# EAGLE design sensors_r (EAGLE 9.5.1)
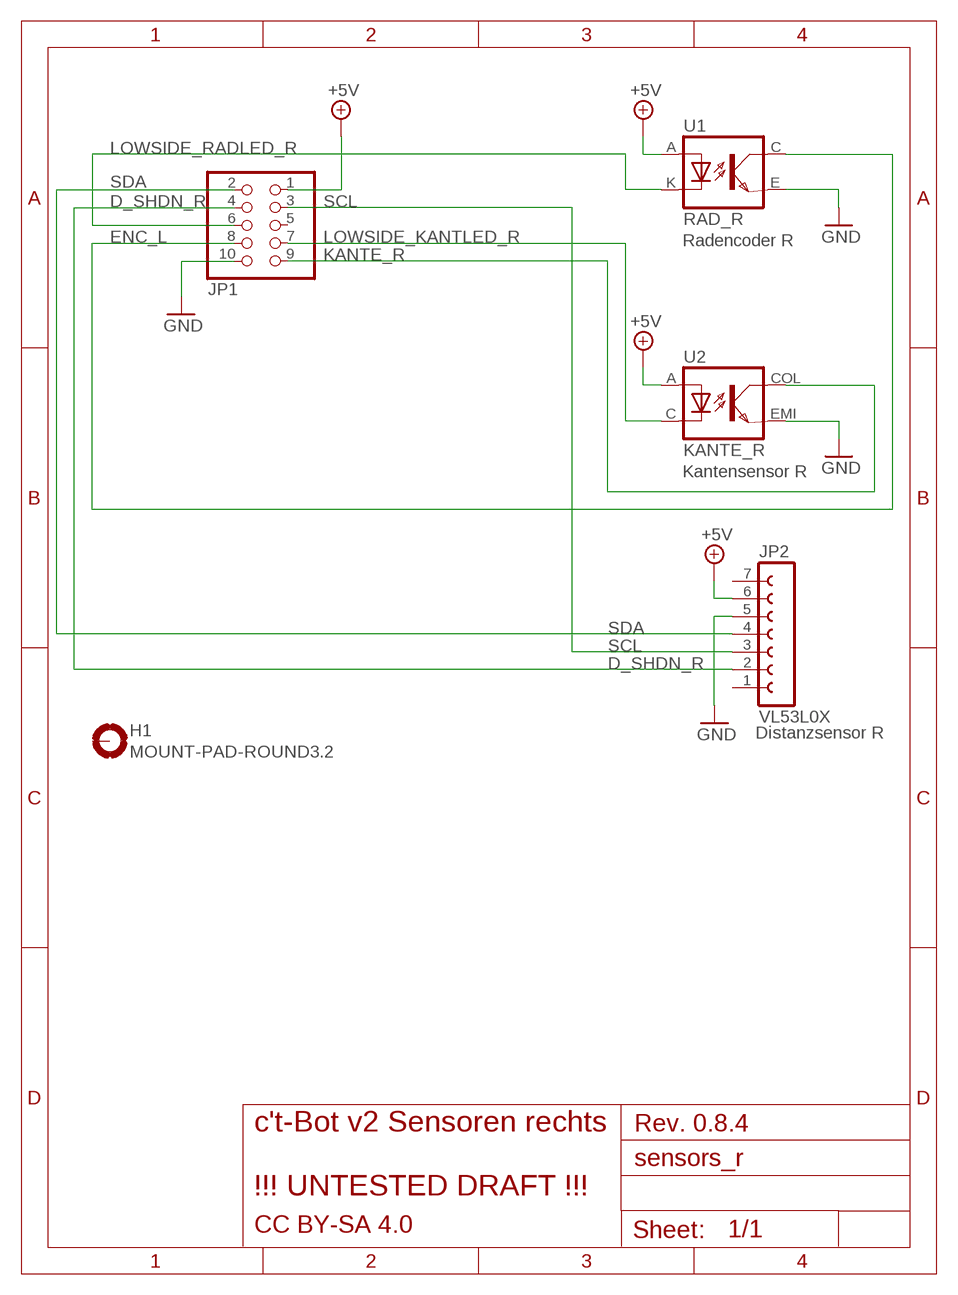
[diagram p0: schematic, sheet 1]

## Parts
H1  MOUNT-PAD-ROUND3.2  [3,2-PAD]
JP1  PINHD-2X5  [2X05]
JP2  VL53L0X  FE07W  [FE07W]
U1  RAD_R  CNY70DEF  [4]
U2  KANTE_R  CNY70  [EDGE]

## Nets
+5V: JP1.1 JP2.6 U1.A U2.A
D_SHDN_R: JP1.4 JP2.2
ENC_L: JP1.8 U1.C(COL)
GND: JP1.10 JP2.5 U1.E(EMI) U2.EMI
KANTE_R: JP1.9 U2.COL
LOWSIDE_KANTLED_R: JP1.7 U2.C
LOWSIDE_RADLED_R: JP1.6 U1.K(C)
SCL: JP1.3 JP2.3
SDA: JP1.2 JP2.4
Unconnected: H1.B3,2(MOUNT) JP1.5 JP2.1 JP2.7

## Notes on the sheet
- Radencoder R
- Kantensensor R
- Distanzsensor R
- Rev. 0.8.4
- c't-Bot v2 Sensoren rechts
  
  !!! UNTESTED DRAFT !!!
- CC BY-SA 4.0

## Library data of the parts
H1 = holes:MOUNT-PAD-ROUND: MOUNTING PAD, round
JP1 = pinhead:PINHD-2X5: PIN HEADER
JP2 = ct-bot:FE07W: FEMALE HEADER; OC_FARNELL: unknown; OC_NEWARK: unknown
U1 U2 = ct-bot:CNY70

## Board
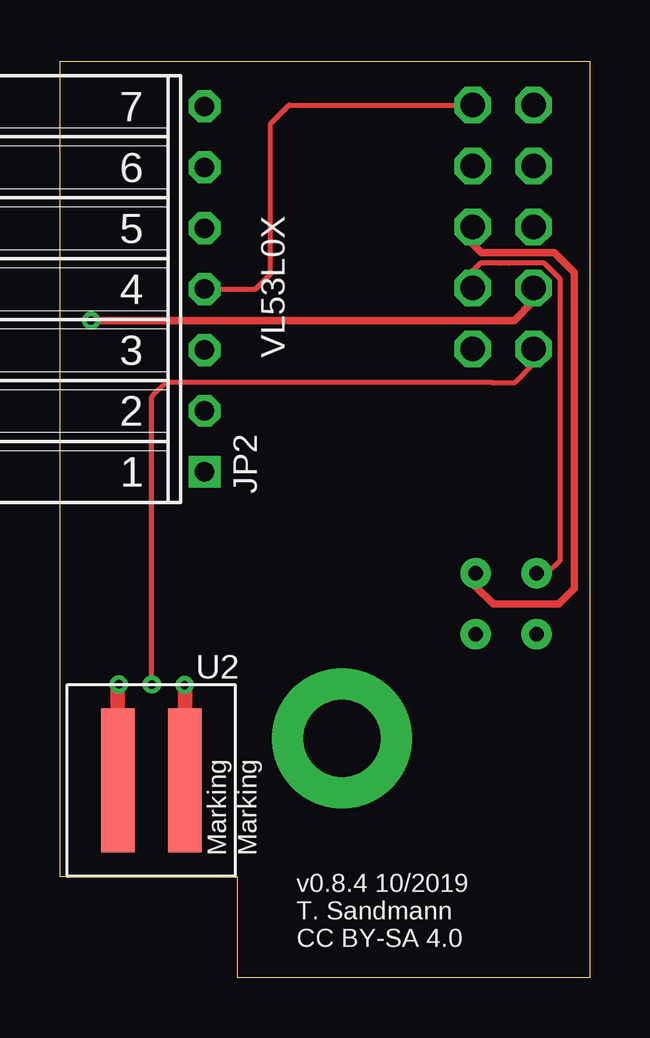
[diagram p1: board, top side]
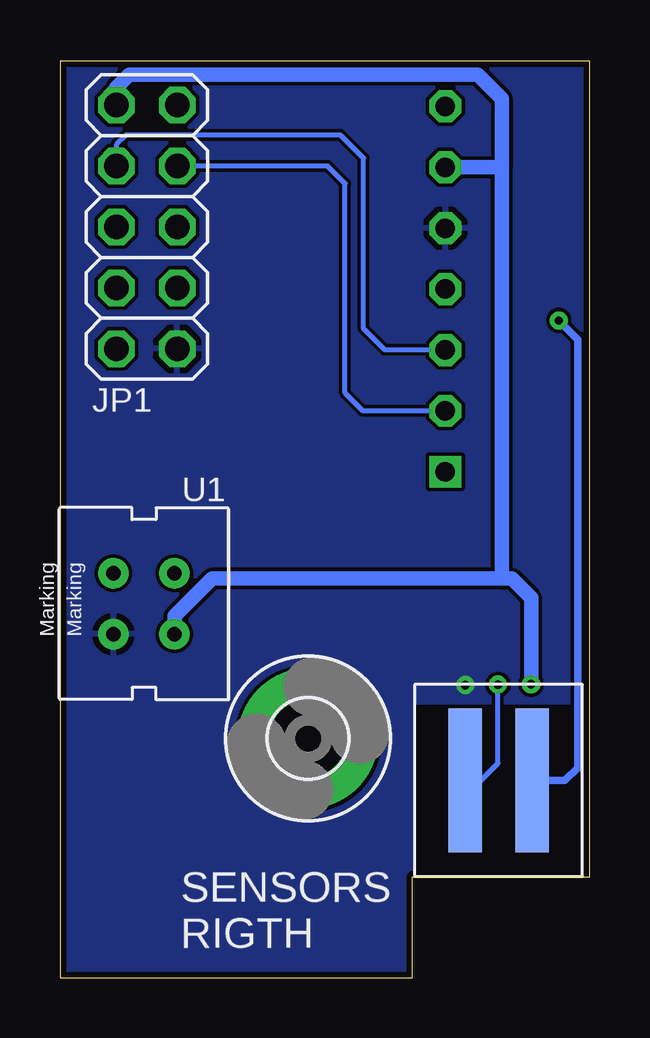
[diagram p2: board, bottom side, seen from below]

Size 22.1 x 38.2 mm. Coordinates in mm from the lower left corner, seen from the top.
Outline: 22.1,0 7.4,0 7.4,4.2 0,4.2 0,38.2 22.1,38.2 22.1,0
Copper layers (1*16): Top 0.035mm / dielectric 1.5mm / Bottom 0.035mm
Design rules "jlcpcb_2layer_DRU": minimum track width 6mil, minimum drill 0.3mm, track to track 6mil, track to pad 6mil, pad to pad 6mil, via to via 6mil, smd to smd 6mil, copper to edge 10mil, drill to drill 6mil, minimum pad ring 10mil, minimum via ring 8mil, stop-mask expansion 4mil, vias tented up to drill 0mil, thermal gap 10mil

### Footprints (pad centres in the part's own frame; a part is rotated, then mirrored left to right if it is on the bottom)
3,2-PAD = drill 3.2 pad 5.842: B3,2 0,0
2X05 = drill 1.016 octagon: 1 -5.08,-1.27; 2 -5.08,1.27; 3 -2.54,-1.27; 4 -2.54,1.27; 5 0,-1.27; 6 0,1.27; 7 2.54,-1.27; 8 2.54,1.27; 9 5.08,-1.27; 10 5.08,1.27
FE07W = drill 0.813 square: 1 -7.62,0 | drill 0.813 octagon: 2 -5.08,0; 3 -2.54,0; 4 0,0; 5 2.54,0; 6 5.08,0; 7 7.62,0
4 = drill 0.61 pad 1.27: A -1.27,1.27; C 1.27,-1.27; E 1.27,1.27; K -1.27,-1.27
EDGE = smd 1.4 x 6: A 0,0; EMI 2.8,0 | smd 1.4 x 6 bottom: C 0,0; COL 2.8,0

### Placement (x,y rotation side)
H1  11.75,9.97 0 bottom
JP1  18.48,31.29 270 bottom
JP2  6.03,28.7 90 top
U1  18.6,15.59 180 bottom
U2  2.41,8.21 0 top

### Tracks (layer width: path | path; a pad name or v marks a point on that pad's centre or on a via)
+5V  (via drill 0.35)
  Top 0.61: U2.A 2.41,12.18 v2.45,12.22
  Bottom 0.61: 3.68,16.63 3.26,16.63 2.45,15.82 v2.45,12.22 | 3.68,16.63 3.68,33.78 | 3.68,33.78 3.68,36.65 4.68,37.64 19.21,37.64 19.75,37.1 JP1.1 | U1.A 17.33,15.07 15.77,16.63 3.68,16.63 | JP2.6 3.68,33.78
D_SHDN_R
  Bottom 0.203: JP1.4 10.94,33.83 10.21,33.1 10.21,24.37 9.46,23.62 JP2.2
ENC_L
  Top 0.203: U1.C 20.33,16.86 20.84,17.37 20.84,29.13 20.19,29.78 18.73,29.78 18.34,29.78 17.52,29.78 17.2,29.46 JP1.8
GND  (via drill 0.35)
  Top 0.61: U2.EMI v5.21,12.18 v5.2,12.2
  pour Bottom (rank 6): 23.42,38.53 -0.75,38.53 -0.75,-0.29 23.42,-0.29
KANTE_R  (via drill 0.35)
  Top 0.203: v3.83,12.21 3.83,24.21 4.43,24.81 17.46,24.81 18.01,24.81 18.98,24.81 19.75,25.58 JP1.9
  Bottom 0.203: U2.COL 4.55,8.21 3.83,8.93 v3.83,12.21
LOWSIDE_KANTLED_R  (via drill 0.35)
  Top 0.305: JP1.7 19.75,28.2 18.94,27.39 v1.3,27.39
  Bottom 0.305: U2.C 1.04,8.21 0.5,8.75 0.5,26.59 v1.3,27.39
LOWSIDE_RADLED_R
  Top 0.305: U1.K 17.33,16.31 18.07,15.57 20.8,15.57 21.44,16.21 21.44,29.39 20.61,30.22 18.73,30.22 18.66,30.22 17.57,30.22 17.2,30.59 JP1.6
N$1
  cutout Bottom: 7.25,11.31 0.3,11.31 0.3,4.22 7.25,4.22
SCL
  Bottom 0.203: JP2.3 8.56,26.16 9.44,27.04 9.44,34.16 10.4,35.12 19.34,35.12 19.75,34.72 JP1.3
SDA
  Top 0.203: JP1.2 9.56,36.37 8.79,35.59 8.79,29.33 8.16,28.7 JP2.4

### Text on the board
tNames: VL53L0X | v0.8.4 10/2019 / T. Sandmann / CC BY-SA 4.0
bNames: SENSORS / RIGTH